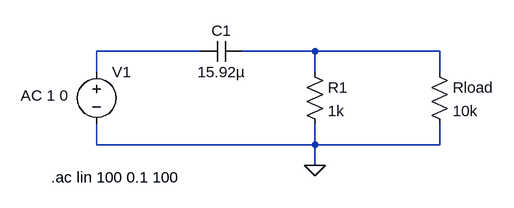
[diagram p0: schematic c01ex39s01.asc]
c01ex39s01.asc, the LTspice schematic file:
Version 4
SHEET 1 880 680
WIRE 224 32 64 32
WIRE 400 32 288 32
WIRE 592 32 400 32
WIRE 64 64 64 32
WIRE 400 64 400 32
WIRE 592 64 592 32
WIRE 64 176 64 144
WIRE 400 176 400 144
WIRE 400 176 64 176
WIRE 592 176 592 144
WIRE 592 176 400 176
WIRE 400 208 400 176
FLAG 400 208 0
SYMBOL cap 288 16 R90
WINDOW 0 0 32 VBottom 2
WINDOW 3 32 32 VTop 2
SYMATTR InstName C1
SYMATTR Value 15.92µ
SYMBOL res 384 48 R0
SYMATTR InstName R1
SYMATTR Value 1k
SYMBOL voltage 64 48 R0
WINDOW 123 -117 52 Left 2
WINDOW 39 0 0 Left 0
SYMATTR InstName V1
SYMATTR Value ""
SYMATTR Value2 AC 1 0
SYMBOL res 576 48 R0
SYMATTR InstName Rload
SYMATTR Value 10k
TEXT -6 226 Left 2 !.ac lin 100 0.1 100

The netlist it stands for:
* c01ex39s01.asc
C1 N002 N001 15.92µ
R1 N002 0 1k
V1 N001 0 AC 1 0
Rload N002 0 10k
.ac lin 100 0.1 100
.backanno
.end